# EAGLE design LR2051-902-sensor-board (EAGLE 9.7.0)
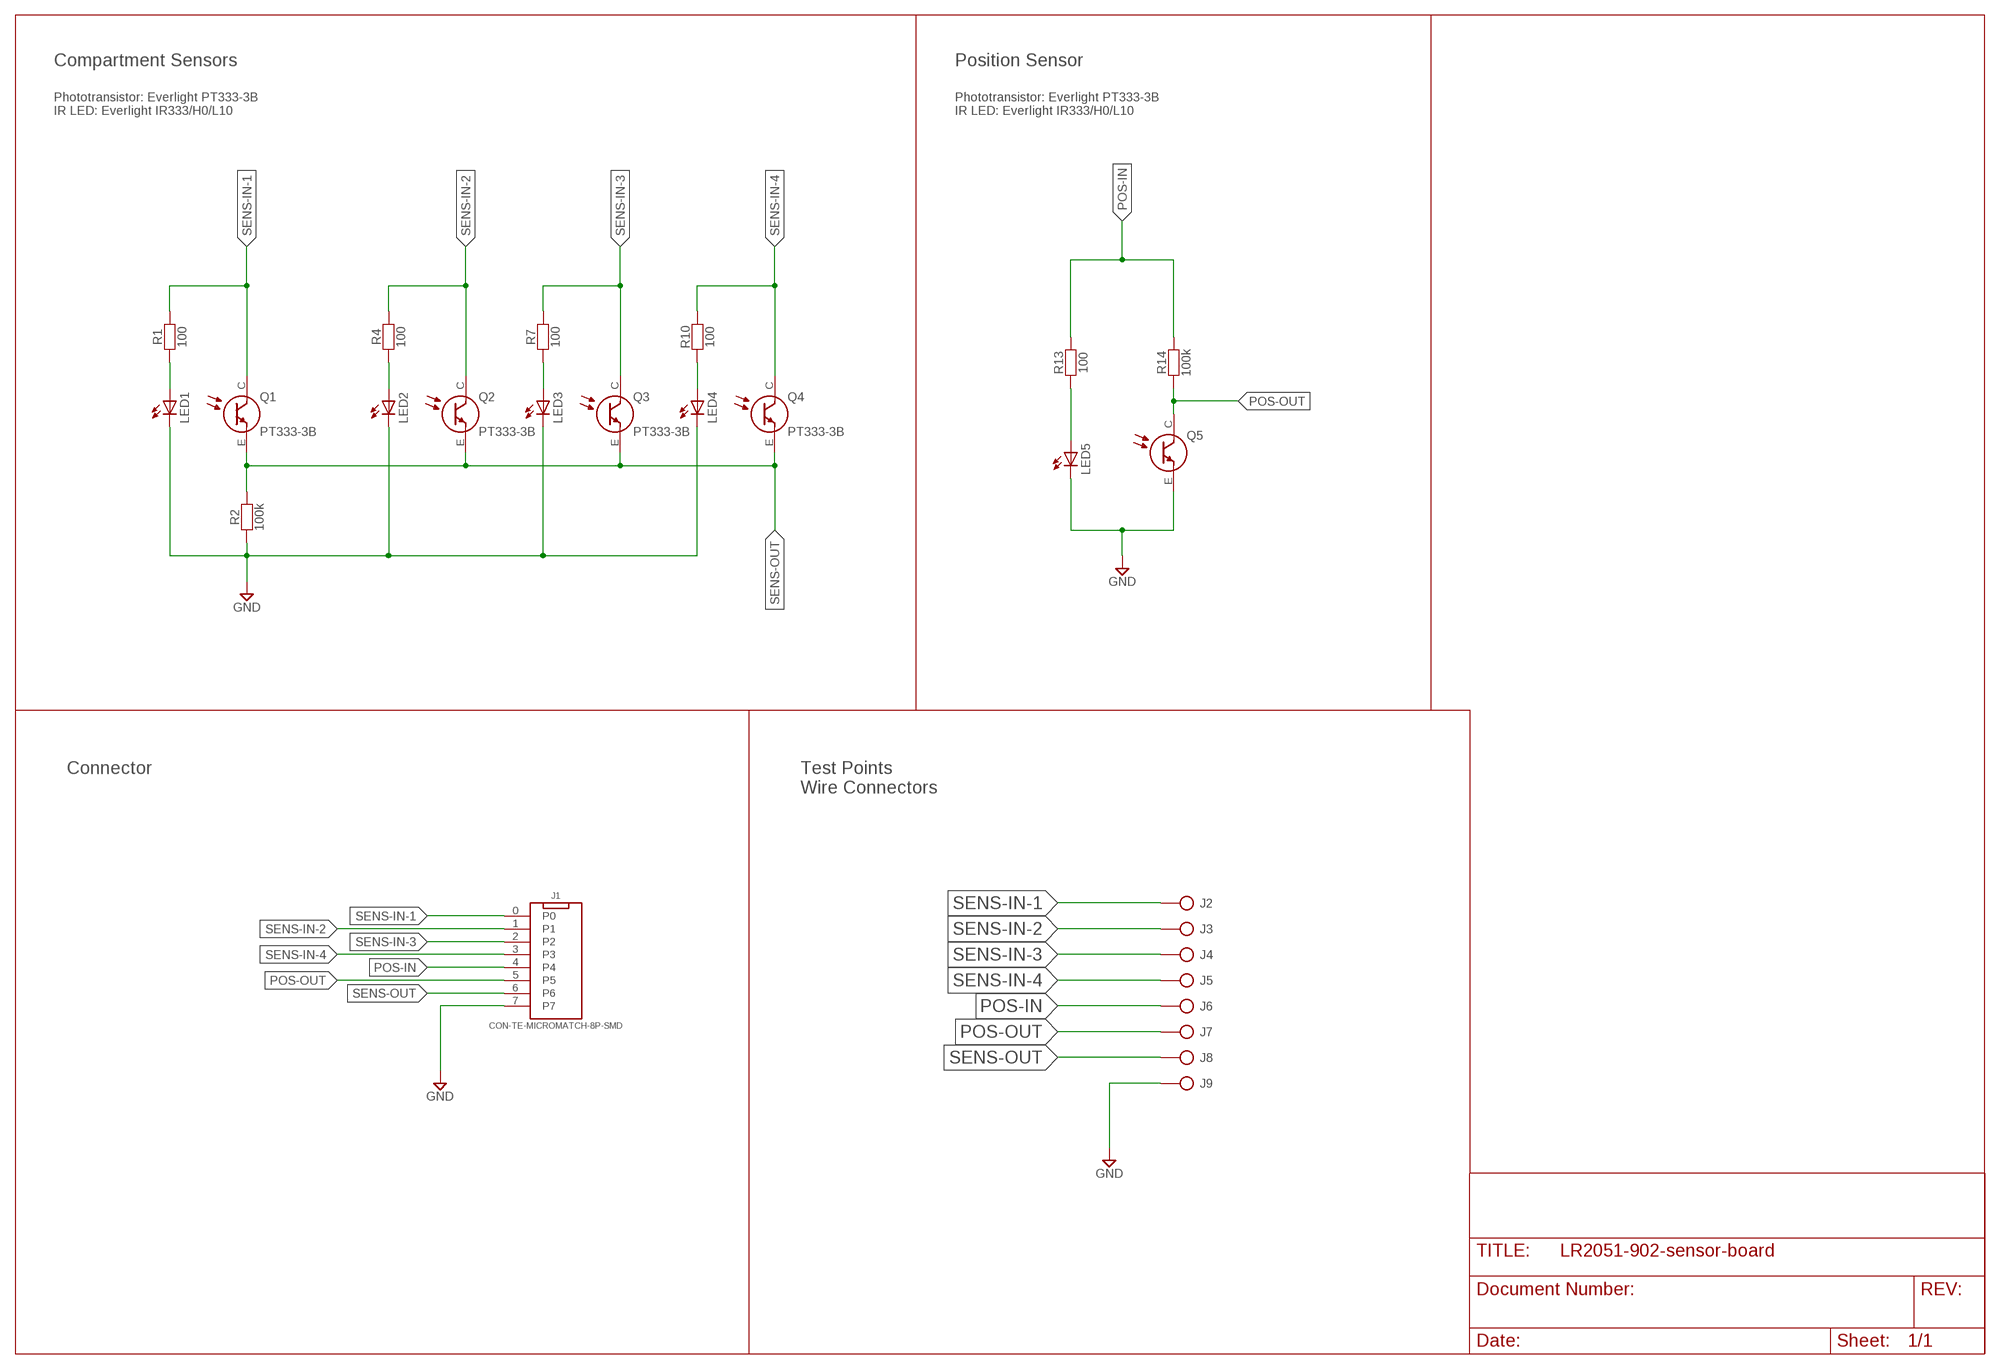
[diagram p0: schematic, sheet 1]

## Parts
J1  CON-TE-MICROMATCH-8P-SMD  [CON-TE-MICROMATCH-2178711-8]
J2  CON-HOLE-D0.9  [CON-HOLE-D0.9]
J3  CON-HOLE-D0.9  [CON-HOLE-D0.9]
J4  CON-HOLE-D0.9  [CON-HOLE-D0.9]
J5  CON-HOLE-D0.9  [CON-HOLE-D0.9]
J6  CON-HOLE-D0.9  [CON-HOLE-D0.9]
J7  CON-HOLE-D0.9  [CON-HOLE-D0.9]
J8  CON-HOLE-D0.9  [CON-HOLE-D0.9]
J9  CON-HOLE-D0.9  [CON-HOLE-D0.9]
LED1  LED5MM  [LED5MM]
LED2  LED5MM  [LED5MM]
LED3  LED5MM  [LED5MM]
LED4  LED5MM  [LED5MM]
LED5  LED5MM  [LED5MM]
Q1  PT333-3B  Q-PHOTO-TH-5MM  [Q-PHOTO-2P-TH-5MM]
Q2  PT333-3B  Q-PHOTO-TH-5MM  [Q-PHOTO-2P-TH-5MM]
Q3  PT333-3B  Q-PHOTO-TH-5MM  [Q-PHOTO-2P-TH-5MM]
Q4  PT333-3B  Q-PHOTO-TH-5MM  [Q-PHOTO-2P-TH-5MM]
Q5  Q-PHOTO-TH-5MM  [Q-PHOTO-2P-TH-5MM]
R1  100  R-0805-HANDSOLDER  [R-0805-HANDSOLDER]
R2  100k  R-0805-HANDSOLDER  [R-0805-HANDSOLDER]
R4  100  R-0805-HANDSOLDER  [R-0805-HANDSOLDER]
R7  100  R-0805-HANDSOLDER  [R-0805-HANDSOLDER]
R10  100  R-0805-HANDSOLDER  [R-0805-HANDSOLDER]
R13  100  R-0805-HANDSOLDER  [R-0805-HANDSOLDER]
R14  100k  R-0805-HANDSOLDER  [R-0805-HANDSOLDER]

## Nets
GND: J1.7 J9.1 LED1.K(C) LED2.K(C) LED3.K(C) LED4.K(C) LED5.K(C) Q5.E R2.1
N$2: LED1.A R1.1
N$5: LED2.A R4.1
N$8: LED3.A R7.1
N$11: LED4.A R10.1
N$14: LED5.A R13.1
POS-IN: J1.4 J6.1 R13.2 R14.2
POS-OUT: J1.5 J7.1 Q5.C R14.1
SENS-IN-1: J1.0 J2.1 Q1.C R1.2
SENS-IN-2: J1.1 J3.1 Q2.C R4.2
SENS-IN-3: J1.2 J4.1 Q3.C R7.2
SENS-IN-4: J1.3 J5.1 Q4.C R10.2
SENS-OUT: J1.6 J8.1 Q1.E Q2.E Q3.E Q4.E R2.2

## Notes on the sheet
- Compartment Sensors | Position Sensor
- Phototransistor: Everlight PT333-3B
  IR LED: Everlight IR333/H0/L10
- Phototransistor: Everlight PT333-3B
  IR LED: Everlight IR333/H0/L10
- Connector
- Test Points
  Wire Connectors

## Library data of the parts
J1 = lucky-resistor-copy:CON-TE-MICROMATCH-8P: TE Micro MaTch connector with 8 positions
J2-J9 = Lucky Resistor Fusion:CON-HOLE: A hole as solder point to attach a wire to the board
LED1-LED5 = Lucky Resistor Fusion:LED
Q1-Q5 = Lucky Resistor Fusion:Q-PHOTO
R1 R2 R4 R7 R10 R13 R14 = Lucky Resistor Fusion:R

## Board
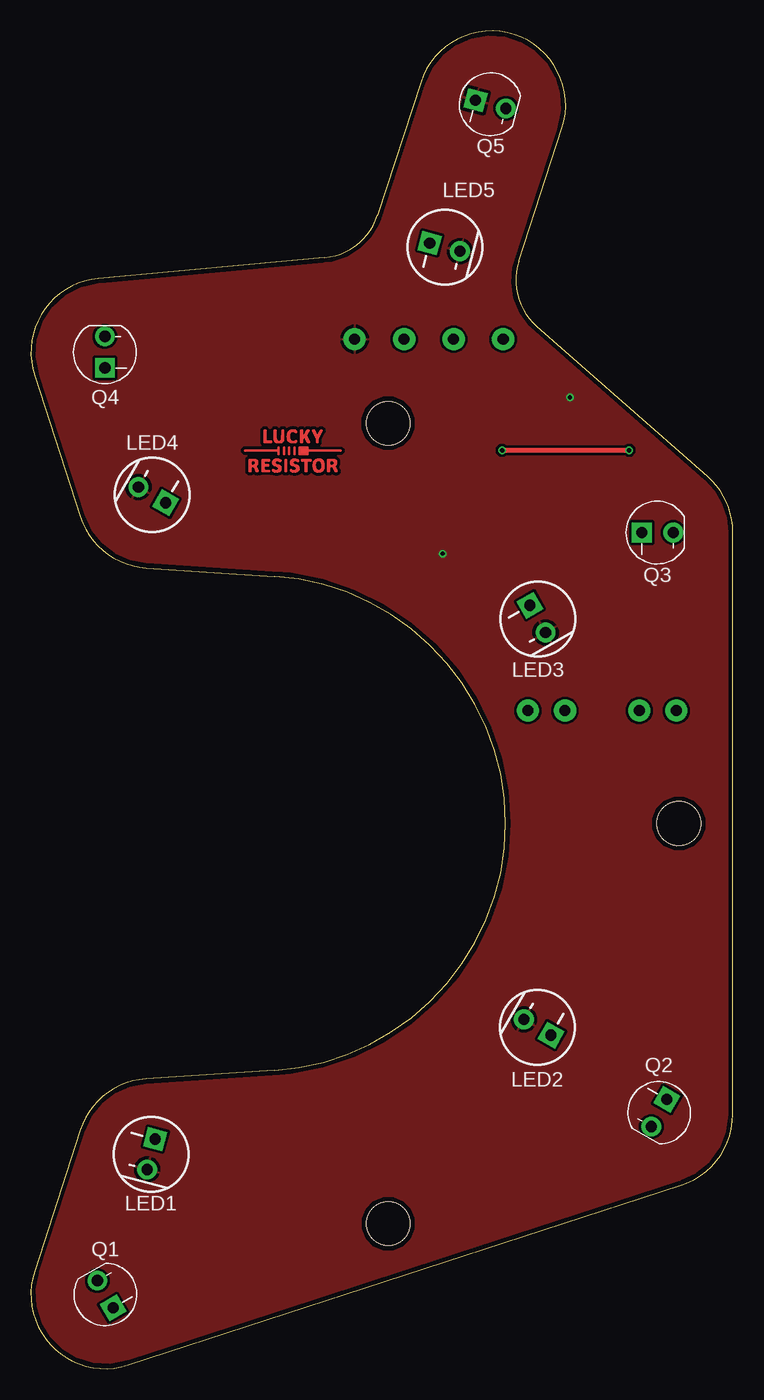
[diagram p1: board, top side]
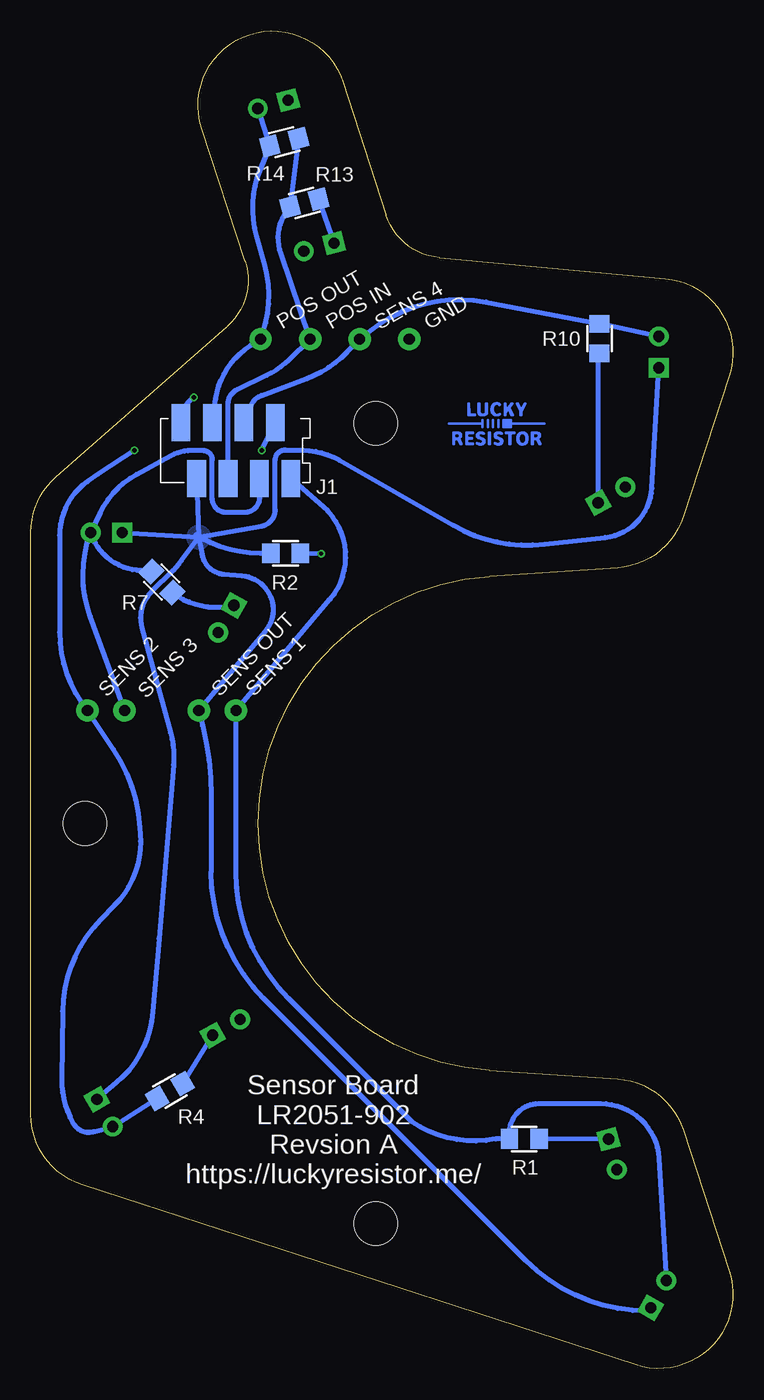
[diagram p2: board, bottom side, seen from below]

Size 56.72 x 108.05 mm. Coordinates in mm from the lower left corner, seen from the top.
Outline: 19.68,24.08 9.31,23.4 arc68 4,19.26 0.29,7.85 arc126 7.85,0.29 52.57,14.82 arc72 56.72,20.53 56.72,67.55 arc49 54.68,72.06 40.88,84.16 arc-67 39.43,89.47 42.92,100.2 arc180 31.5,103.91 28.01,93.17 arc-67 23.72,89.74 5.45,88.06 arc103 0.29,80.23 4,68.82 arc68 9.31,64.68 19.68,64 arc-172 19.68,24.08
Copper layers (1*16): Top 0.035559375mm / dielectric 1.6mm / Bottom 0.035559375mm
Design rules "oshpark-2layer": minimum track width 6mil, minimum drill 10mil, track to track 6mil, track to pad 6mil, pad to pad 6mil, via to via 6mil, smd to smd 6mil, copper to edge 15mil, drill to drill 6mil, minimum pad ring 5mil, minimum via ring 5mil, stop-mask expansion 2.5mil, vias tented up to drill 0mil, thermal gap 10mil
Holes 3.5 mm at 28.86,76.37 52.35,44.03 28.86,11.7

### Footprints (pad centres in the part's own frame; a part is rotated, then mirrored left to right if it is on the bottom)
CON-TE-MICROMATCH-2178711-8 = smd 1.5 x 3: 0 4.445,-2.25; 1 3.175,2.25; 2 1.905,-2.25; 3 0.635,2.25; 4 -0.635,-2.25; 5 -1.905,2.25; 6 -3.175,-2.25; 7 -4.445,2.25
CON-HOLE-D0.9 = drill 0.9 pad 1.8: 1 0,0
LED5MM = drill 0.9 pad 1.6 square: A -1.27,0 | drill 0.9 pad 1.6: K 1.27,0
Q-PHOTO-2P-TH-5MM = drill 0.9 pad 1.6: C 1.27,0 | drill 0.9 pad 1.6 square: E -1.27,0
R-0805-HANDSOLDER = smd 1.4 x 1.6: 1 -1.2,0; 2 1.2,0

### Placement (x,y rotation side)
J1  40.16,74.16 0 bottom
J2  40.16,53.16 0 bottom
J3  52.16,53.16 0 bottom
J4  49.16,53.16 0 bottom
J5  30.16,83.16 0 bottom
J6  34.16,83.16 0 bottom
J7  38.16,83.16 0 bottom
J8  43.16,53.16 0 bottom
J9  26.16,83.16 0 bottom
LED1  9.72,17.31 255 top
LED2  40.93,27.57 150 top
LED3  40.96,60.56 300 top
LED4  9.79,70.58 150 top
LED5  33.45,90.6 345 top
Q1  6.01,6.01 120 top
Q2  50.76,20.65 240 top
Q3  50.63,67.54 0 top
Q4  5.98,82.11 90 top
Q5  37.16,102.13 345 top
R1  16.86,18.55 180 bottom
R2  36.15,65.86 180 bottom
R4  45.49,22.42 210 bottom
R7  46.15,63.54 135 bottom
R10  10.78,83.2 90 bottom
R13  34.63,94.16 195 bottom
R14  36.25,99.07 15 bottom
U$1  [LR_LOGO_COPPER_8MM_NOMASK]  21.16,74.16 0 top
U$2  [LR_LOGO_COPPER_8MM_NOMASK]  19.1,76.35 0 bottom

### Tracks (layer width: path | path; a pad name or v marks a point on that pad's centre or on a via)
GND  (via drill 0.35, 0.35 pad 0.6)
  Bottom 0.4: J1.7 44.6,77.41 v43.56,78.46 | R2.1 v33.28,65.84
  pour Top (isolate 0.2): 4,19.26 0.29,7.85 arc126 7.85,0.29 52.57,14.82 arc72 56.72,20.53 56.72,67.55 arc49 54.68,72.06 40.88,84.16 arc-67 39.43,89.47 42.91,100.2 arc180 31.5,103.91 28.01,93.17 arc-67 23.72,89.74 5.45,88.06 arc103 0.29,80.23 4,68.82 arc68 9.31,64.68 19.68,64 arc-172 19.68,24.08 9.31,23.4 arc68
N$2
  Bottom 0.4: LED1.A R1.1
N$5
  Bottom 0.4: R4.1 LED2.A
N$8
  Bottom 0.4: R7.1 arc-50 LED3.A
N$11
  Bottom 0.4: LED4.A 10.89,81.89 R10.1
N$14
  Bottom 0.4: R13.1 LED5.A
POS-IN
  Bottom 0.4: J1.4 40.79,77.7 40.79,77.94 arc64 40.06,79.09 37.68,80.24 arc-18 35.88,81.5 J6.1 36.53,90.08 arc60 R13.2 R14.2
POS-OUT
  Bottom 0.4: Q5.C R14.1 38.2,96.77 arc-37 38.49,91.5 37.82,89.09 arc34 37.97,83.71 J7.1 38.97,82.64 arc-50 41.78,78.33 J1.5
SENS-IN-1
  Bottom 0.4: Q1.C 5.97,16.98 arc-87 10.67,21.41 15.7,21.41 arc-88 18.03,19.15 R1.2 19.16,18.55 arc45 25.94,19.94 35.91,29.91 arc45 40.16,40.16 J2.1 32.54,62.16 arc-89 33.09,69.61 J1.0
SENS-IN-2  (via drill 0.35)
  Top 0.4: v38.07,74.18 v48.35,74.19
  Bottom 0.4: R4.2 Q2.C 51.69,19.14 arc75 53.31,19.81 arc31 54.23,23.35 54.16,28.88 arc44 51.08,36.27 49.98,37.39 arc-44 47.86,42.58 47.93,43.72 arc-30 50.06,50.02 J3.1 arc39 54.41,59.48 54.41,67.3 arc55 52.16,71.65 51.25,72.29 v48.35,74.19 | J1.1 v38.07,74.18
SENS-IN-3
  Bottom 0.4: J1.2 38.25,70.36 arc90 39.46,69.16 40.95,69.16 arc90 42.07,70.27 42.07,73.43 arc-90 42.8,74.16 43.76,74.16 arc-29 45.41,73.74 48.19,72.22 arc-36 51.12,69.14 Q3.C | R7.2 48.14,64.49 arc61 51.68,67.05 Q3.C | J4.1 51.92,60.77 arc40 Q3.C
SENS-IN-4
  Bottom 0.4: J1.3 38.93,77.81 arc47 38.1,78.6 34.44,79.98 arc-25 31.15,82.13 J5.1 29.3,83.84 arc50 19.94,86.16 R10.2 Q4.C
SENS-OUT
  Bottom 0.4: Q2.E 49.83,23.06 arc-45 46.87,28.81 46.38,34.71 45.2,48.78 arc-20 45.43,51.35 47.75,59.87 arc60 47,62.72 45.25,64.46 arc-8 44.56,65.26 43.16,67.16 | 43.16,67.16 38.08,68.05 arc-80 36.99,69.36 36.99,73.42 arc90 36.17,74.21 34.72,74.18 arc29 31.8,73.38 22.61,68.13 arc-36 15.2,66.6 10.32,67.14 arc-80 6.55,71.11 Q4.E | J1.6 43.16,67.16 | 43.16,67.16 43.4,67.34 | Q1.E 6.9,4.65 arc45 16.71,8.71 37.91,29.91 arc45 42.16,40.16 42.16,46.29 arc-14 42.85,51.94 J8.1 37.79,59.55 arc-125 39.66,64.04 41.14,64.17 arc75 42.9,65.77 43.16,67.16 | Q3.E 43.16,67.16 | R2.2 arc31 42.99,67.07 43.16,67.16
  pour Bottom: 43.16,68.16 arc90 42.16,67.16 arc90 43.16,66.16 arc90 44.16,67.16 arc90

### Text on the board
bPlace: GND | SENS 4 | POS IN | POS OUT | SENS 1 | SENS OUT | SENS 3 | SENS 2 | Sensor Board / LR2051-902 / Revsion A / https://luckyresistor.me/